# Altium schematic sheet TOP.SchDoc
size A4
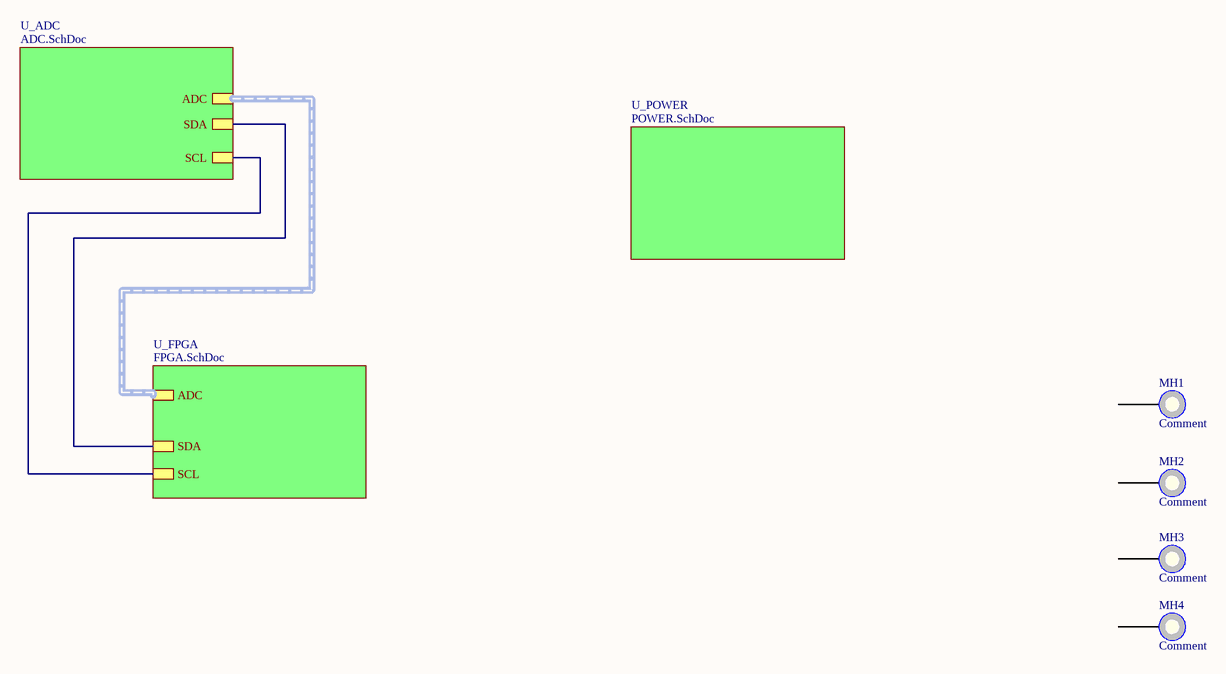
[diagram p0: TOP.SchDoc]

## Parts
MH1  Comment  [m3_3.2x6]  (no BOM)
MH2  Comment  [m3_3.2x6]  (no BOM)
MH3  Comment  [m3_3.2x6]  (no BOM)
MH4  Comment  [m3_3.2x6]  (no BOM)

## Sub-sheets
U_ADC = ADC.SchDoc: SDA, SCL, ADC (harness CHANNEL)
U_FPGA = FPGA.SchDoc: SDA, SCL, ADC (harness CHANNEL)
U_POWER = POWER.SchDoc: no entries

## Nets
(unnamed): sheet U_ADC/SDA, sheet U_FPGA/SDA
(unnamed): sheet U_ADC/SCL, sheet U_FPGA/SCL

Not connected (* = marked no-connect by the designer): MH1 1; MH2 1; MH3 1; MH4 1

## Buses and harness runs
harness sheet U_ADC/ADC = sheet U_FPGA/ADC

## Library data of the parts
MH1-MH4 = M3_Vida: Que: 022; DesignItemID: Mounting Hole; Created On: 13.02.2020; Created By: Recep Aydin; Category: Miscellaneous; Part Number: M3_Vida